# Altium schematic sheet max485.SchDoc
size A4
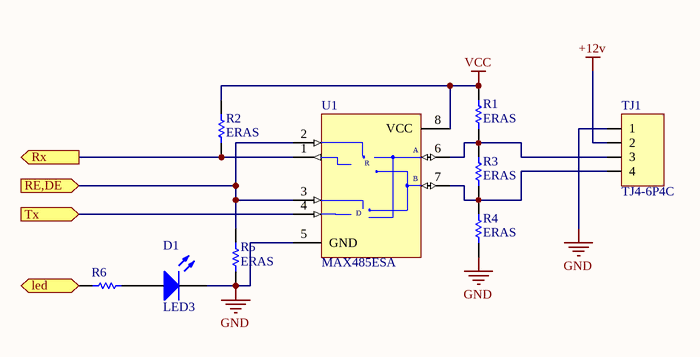
[diagram p0: max485.SchDoc]

## Parts
D1  LED3  [3.5X2.8X1.9]
R1  ERAS  [ERA-0805]
R2  ERAS  [ERA-0805]
R3  ERAS  [ERA-0805]
R4  ERAS  [ERA-0805]
R5  ERAS  [ERA-0805]
R6  ERAS  [ERA-0805]  (value not drawn)
TJ1  TJ4-6P4C  [TJ4-6P4C]
U1  MAX485ESA  [NSO8_N]

## Ports
led (in), RE,DE (in), Rx (out), Tx (in)

## Nets
+12v: TJ1.2
GND: D1.2(K) R4.2 R5.2 TJ1.1 U1.5(GND)
VCC: R1.1 R2.1 U1.8(VCC)
led: R6.1 ; port led
RE,DE: R5.1 U1.2(~{RE}) U1.3(DE) ; port RE,DE
Rx: R2.2 U1.1(RO) ; port Rx
Tx: U1.4(DI) ; port Tx
NetD1_1: D1.1(A) R6.2
NetR1_2: R1.2 R3.1 TJ1.3 U1.6(A)
NetR3_2: R3.2 R4.1 TJ1.4 U1.7(B)

## Notes on the sheet
- (in symbol MAX485ESA) R; D

## Library data of the parts
D1 = LED3: Typical BLUE SiC LED; Published: 8-Jun-2000; LatestRevisionDate: 17-Dec-2003; LatestRevisionNote: PCB Footprint replaced.; DatasheetVersion: 16-Apr-2002; PackageVersion: 16-Apr-2002; PackageReference: 3.5X2.8X1.9; Publisher: Altium Limited; PackageDescription: SM LED; 2 C-Bend Leads; Body 3.5 x 2.8 x 1.9 mm, inc leads (LxWxH typ)
R1-R6 = ERAS: Metal Film Thermosensitive Chip Resistor, 0.56 Ohm to 10k Ohm Range, 5% Tolerance, 0805 Size, 0.1 W; Note: If flow soldering, adjust pad width of PCB Footprint to 0.7 - 0.8 times the width of the resistor.; Published: 17-Dec-2003; LatestRevisionDate: 19-Mar-2004; LatestRevisionNote: Silkscreen size reduced.; PackageDocument: Mar-2003; PackageReference: ERA-0805; Publisher: Altium Limited; Code_IPC: 2012 [0805]; ComponentLink1Description: Manufacturer Link; ComponentLink1URL: http://www.panasonic.com/industrial/components/resistive_products.htm; ComponentLink2Description: Datasheet; ComponentLink2URL: http://www.panasonic.com/industrial/components/pdf/AOF0000CE1.pdf
U1 = MAX485ESA: Low-Power, Slew-Rate-Limited RS-485/RS-422 Transceiver; Published: 16-Jan-2001; LatestRevisionDate: 13-Apr-2006; LatestRevisionNote: IPC-7351 Footprint Added.; DatasheetVersion: Feb-1996; PackageReference: NSO8; Publisher: Altium Limited; PackageDescription: 8-Pin Small Outline Integrated Circuit 1.27 mm Pitch; Code_JEDEC: MS-012-AA; Code_IPC: SOIC127P600-8; ComponentLink1Description: Manufacturer Link; ComponentLink1URL: http://www.maxim-ic.com/; ComponentLink2Description: Datasheet; ComponentLink2URL: http://pdfserv.maxim-ic.com/en/ds/MAX1487-MAX491.pdf